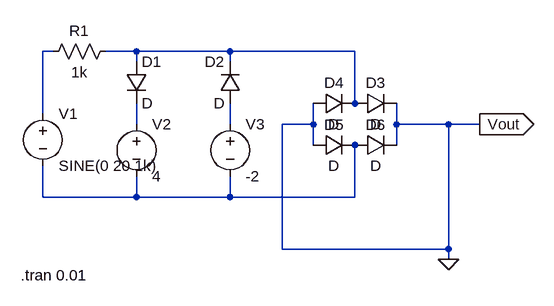
[diagram p0: schematic Draft3.asc]
Draft3.asc, the LTspice schematic file:
Version 4
SHEET 1 880 680
WIRE 80 16 64 16
WIRE 208 16 160 16
WIRE 352 16 208 16
WIRE 544 16 352 16
WIRE 208 32 208 16
WIRE 352 32 352 16
WIRE 544 96 544 16
WIRE 64 112 64 16
WIRE 208 128 208 96
WIRE 352 128 352 96
WIRE 480 128 480 96
WIRE 480 128 432 128
WIRE 608 128 608 96
WIRE 688 128 608 128
WIRE 736 128 688 128
WIRE 480 160 480 128
WIRE 608 160 608 128
WIRE 64 240 64 192
WIRE 208 240 208 208
WIRE 208 240 64 240
WIRE 352 240 352 208
WIRE 352 240 208 240
WIRE 544 240 544 160
WIRE 544 240 352 240
WIRE 432 320 432 128
WIRE 688 320 688 128
WIRE 688 320 432 320
WIRE 688 336 688 320
FLAG 688 336 0
FLAG 736 128 Vout
IOPIN 736 128 Out
SYMBOL voltage 64 96 R0
WINDOW 123 0 0 Left 0
WINDOW 39 0 0 Left 0
SYMATTR InstName V1
SYMATTR Value SINE(0 20 1k)
SYMBOL diode 192 32 R0
SYMATTR InstName D1
SYMBOL voltage 208 112 R0
WINDOW 123 0 0 Left 0
WINDOW 39 0 0 Left 0
SYMATTR InstName V2
SYMATTR Value 4
SYMBOL voltage 352 112 R0
WINDOW 123 0 0 Left 0
WINDOW 39 0 0 Left 0
SYMATTR InstName V3
SYMATTR Value -2
SYMBOL diode 368 96 R180
WINDOW 0 24 64 Left 2
WINDOW 3 24 0 Left 2
SYMATTR InstName D2
SYMBOL res 176 0 R90
WINDOW 0 0 56 VBottom 2
WINDOW 3 32 56 VTop 2
SYMATTR InstName R1
SYMATTR Value 1k
SYMBOL diode 544 112 R270
WINDOW 0 32 32 VTop 2
WINDOW 3 0 32 VBottom 2
SYMATTR InstName D3
SYMBOL diode 480 112 R270
WINDOW 0 32 32 VTop 2
WINDOW 3 0 32 VBottom 2
SYMATTR InstName D4
SYMBOL diode 480 176 R270
WINDOW 0 32 32 VTop 2
WINDOW 3 0 32 VBottom 2
SYMATTR InstName D5
SYMBOL diode 544 176 R270
WINDOW 0 32 32 VTop 2
WINDOW 3 0 32 VBottom 2
SYMATTR InstName D6
TEXT 30 360 Left 2 !.tran 0.01

The netlist it stands for:
* Draft3.asc
V1 N001 N005 SINE(0 20 1k)
D1 N002 N003 D
V2 N003 N005 4
V3 N004 N005 -2
D2 N004 N002 D
R1 N002 N001 1k
D3 N002 0 D
D4 0 N002 D
D5 0 N005 D
D6 N005 0 D
.model D D
.lib standard.dio
.tran 0.01
.backanno
.end